# Altium schematic sheet MCU.SchDoc
size A4; SheetNumber: 2; SheetTotal: 6
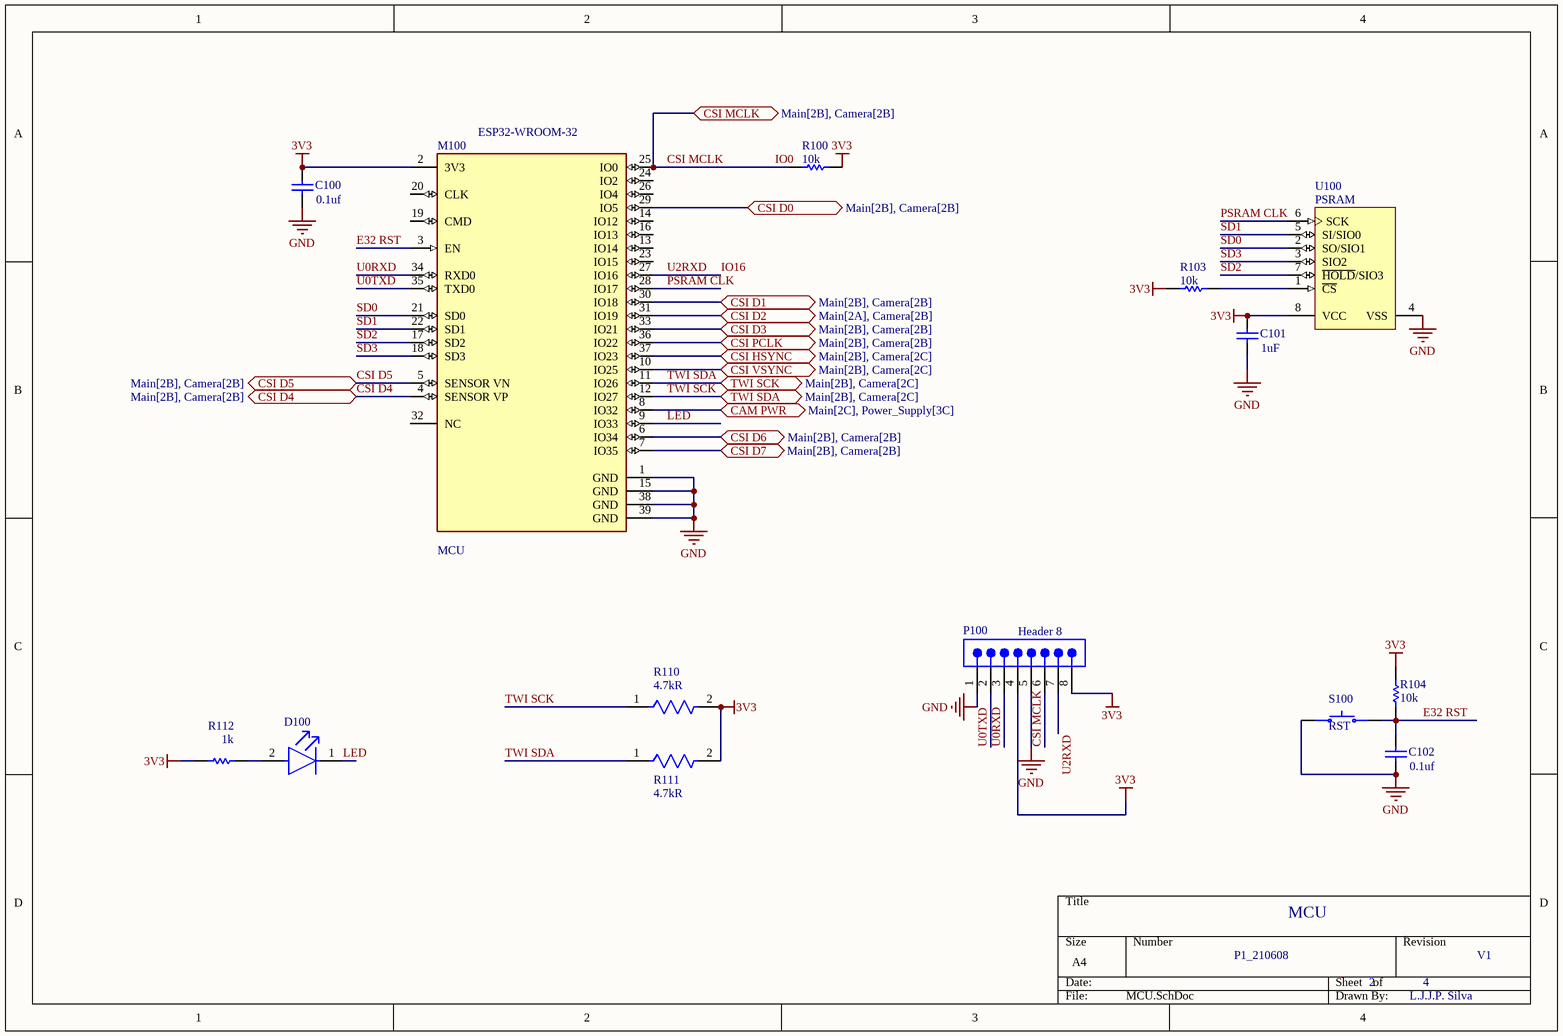
[diagram p0: MCU.SchDoc]

## Parts
C100  Parameter 1: 0.1uf  [CAPC2013X140X50NL20T25]  (hidden comment: 08055C104K4Z2A)
C101  Parameter 1: 1uF  [CAPC2013X145X50LL20T25]  (hidden comment: C0805C105K4PACTU)
C102  Parameter 1: 0.1uf  [CAPC2013X140X50NL20T25]  (hidden comment: 08055C104K4Z2A)
D100  LTST-C190GKT  [FP-LTST-C190GKT-MFG]  (value not drawn)
M100  ESP32-WROOM-32  [FP-ESP32-WROOM-32-MFG]
P100  Header 8  [66200811122]
R100  Parameter 1: 10k  [RESC1609X50X30NL8T20]  (hidden comment: CRCW060310K0FKEA)
R103  Parameter 1: 10k  [RESC1609X50X30NL8T20]  (hidden comment: CRCW060310K0FKEA)
R104  Parameter 1: 10k  [RESC1609X50X30NL8T20]  (hidden comment: CRCW060310K0FKEA)
R110  Resistance: 4.7kR  [FP-ERA3A-IPC_B]  (hidden comment: ERA-3AEB472V)
R111  Resistance: 4.7kR  [FP-ERA3A-IPC_B]  (hidden comment: ERA-3AEB472V)
R112  Parameter 1: 1k  [RESC1608X55X30LL15T15]  (hidden comment: ERJ-3EKF1001V)
S100  value RST  [SW_SKSTACE010]  (hidden comment: SKSTACE010)
U100  PSRAM  [MCHP-SOIC-SN8_N]

## Ports
CAM PWR (bidir, see Main[2C], Power_Supply[3C]), CSI D0 (bidir, see Main[2B], Camera[2B]), CSI D1 (bidir, see Main[2B], Camera[2B]), CSI D2 (bidir, see Main[2A], Camera[2B]), CSI D3 (bidir, see Main[2B], Camera[2B]), CSI D4 (bidir, see Main[2B], Camera[2B]), CSI D5 (bidir, see Main[2B], Camera[2B]), CSI D6 (bidir, see Main[2B], Camera[2B]), CSI D7 (bidir, see Main[2B], Camera[2B]), CSI HSYNC (bidir, see Main[2B], Camera[2C]), CSI MCLK (bidir, see Main[2B], Camera[2B]), CSI PCLK (bidir, see Main[2B], Camera[2B]), CSI VSYNC (bidir, see Main[2B], Camera[2C]), TWI SCK (bidir, see Main[2B], Camera[2C]), TWI SDA (bidir, see Main[2B], Camera[2C])

## Nets
3V3: C100.2 C101.2 M100.2(3V3) P100.4 P100.8 R100.2 R103.2 R104.2 R110.2 R111.2 R112.1 U100.8(VCC)
GND: C100.1 C101.1 C102.1 M100.1(GND) M100.15(GND) M100.38(GND) M100.39(GND) P100.1 P100.5 S100.1 U100.4(VSS)
CAM PWR: M100.8(IO32) ; port CAM PWR
CSI D0: M100.29(IO5) ; port CSI D0
CSI D1: M100.30(IO18) ; port CSI D1
CSI D2: M100.31(IO19) ; port CSI D2
CSI D3: M100.33(IO21) ; port CSI D3
CSI D4: M100.4(SENSOR_VP) ; port CSI D4
CSI D5: M100.5(SENSOR_VN) ; port CSI D5
CSI D6: M100.6(IO34) ; port CSI D6
CSI D7: M100.7(IO35) ; port CSI D7
CSI HSYNC: M100.37(IO23) ; port CSI HSYNC
CSI MCLK: M100.25(IO0) P100.6 R100.1 ; port CSI MCLK  [also labelled IO0]
CSI PCLK: M100.36(IO22) ; port CSI PCLK
CSI VSYNC: M100.10(IO25) ; port CSI VSYNC
E32 RST: C102.2 M100.3(EN) R104.1 S100.2
IO16: M100.27(IO16) P100.7  [also labelled U2RXD]
LED: D100.1(C) M100.9(IO33)
PSRAM CLK: M100.28(IO17) U100.6(SCK)
SD0: M100.21(SD0) U100.2(SO/SIO1)
SD1: M100.22(SD1) U100.5(SI/SIO0)
SD2: M100.17(SD2) U100.7(~{HOLD}/SIO3)
SD3: M100.18(SD3) U100.3(SIO2)
TWI SCK: M100.12(IO27) R110.1 ; port TWI SDA
TWI SDA: M100.11(IO26) R111.1 ; port TWI SCK
U0RXD: M100.34(RXD0) P100.3
U0TXD: M100.35(TXD0) P100.2
NetD100_2: D100.2(A) R112.2
NetR103_1: R103.1 U100.1(~{CS})

Not connected (* = marked no-connect by the designer): M100 13(IO14) 14(IO12) 16(IO13) 19(CMD) 20(CLK) 23(IO15) 24(IO2) 26(IO4) 32(NC)

## Notes on the sheet
- (near M100) MCU
- MCU
- P1_210608
- 2
- 4
- V1
- L.J.J.P. Silva

## Library data of the parts
C100 C102 = CMP-2007-04629-1: Manufacturer: AVX Interconnect / Elco; Part Number: 08055C104K4Z2A
C101 = CMP-1036-04746-2: Manufacturer: Kemet; Part Number: C0805C105K4PACTU
D100 = CMP-22017-000005-2: LED GREEN CLEAR CHIP SMD; Dominant Wavelength: 569nm; Reverse Voltage: 5V; Lens Color: Colorless; Viewing Angle: 130°; Voltage: 2V; Forward Current: 30mA; Power Dissipation: 100mW; Luminous Intensity: 6mcd; Number of LEDs: 1; Forward Voltage: 2.1V; Wavelength: 565nm; Test Current: 10mA; Min Operating Temperature: -55°C; Lens Style: Clear; Mount: Surface Mount; Width: 0.8mm; Packaging: Tape and Reel; Lens Transparency: Clear; Case Code (Metric): 1608; Depth: 0.8mm; Case Code (Imperial): 0603; Case/Package: 0603; Number of Pins: 2; Max Operating Temperature: 85°C; Lead Free: Lead Free; Number of Elements: 1; Length: 1.6mm; Height: 0.8mm; Package Quantity: 1; Power Rating: 100mW; Radiation Hardening: No; Illumination Color: Green; Color: Green; Parameter 1: LED
M100 = CMP-194065-000008-1: RX TXRX MOD WIFI SURFACE MOUNT; Frequency: 2.5GHz; Sensitivity: -98dBm; Operating Supply Voltage: 3.6V; Data Rate: 150Mbps; Weight: 0.088185oz; Package Quantity: 550; Min Operating Temperature: -40°C; Mount: Surface Mount; Max Operating Temperature: 85°C; Packaging: Cut Tape; Case/Package: SMD/SMT
P100 = CMP-1502-00446-2: NexarPartId: 23024701; Pitch: 3mm; Number of Contacts: 8; Insulation Resistance: 1GΩ; Connector Type: Male Pin, Socket; Contact Resistance: 10mΩ; Gender: Male; Current Rating: 5A; Operating Supply Voltage: 250V; Height: 11mm; Max Operating Temperature: 105°C; Mount: Through Hole; Orientation: Vertical; Fastening Type: Ramp; Number of Positions: 8; Lead Pitch: 3mm; Number of Rows: 1; RoHS: Compliant; Termination: Kinked Pin; Width: 27.65mm; Contact Material: Copper; REACH SVHC: Unknown; Contact Plating: Tin; Length: 27.65mm; Color: Black; Min Operating Temperature: -40°C; Number of Pins: 8
R100 R103 R104 = CMP-1666-00005-4: Chip Resistor, 10 KOhm, +/- 1%, 100 mW, -55 to 155 degC, 0603 (1608 Metric), RoHS, Tape and Reel; Manufacturer: Vishay Semiconductor; Voltage Rating: 75 V; Max Operating Temperature: 155 degC; PackageDescription: 2-Pin Surface Mount Device, Body 1.575 x 0.85 mm; ComponentLink1Description: Manufacturer URL; RoHSCompliant: true; PackageReference: 0603; REACH SVHC: Unknown; Length: 1.55 mm; DatasheetVersion: 06/2012; Packaging: Tape and Reel; Min Operating Temperature: -55 degC; Mounting Technology: Surface Mount; ComponentLink2URL: https://datasheet.ciiva.com/11809/0900766b80d98afc-11809037.pdf; Height: 0.45 mm; ComponentLink2Description: Datasheet; Package Quantity: 5000; ComponentLink1URL: http://www.vishay.com/
R110 R111 = CMP-2000-00072-2: RES SMD 4.7K OHM 0.1% 1/10W 0603; Voltage Rating: 75V; Max Power Dissipation: 100mW; Temperature Coefficient: 25ppm/°C; Case Code (Imperial): 0603; RoHS Compliant: Yes; Number of Pins: 2; REACH SVHC: No SVHC; Height: 0.45mm; Lead Free: Lead Free; Packaging: Tape and Reel; Width: 0.8mm; Termination: SMD/SMT; Radiation Hardening: No; Working Voltage: 75V; Max Operating Temperature: 155°C; Resistance Tolerance: 0.1%; Min Operating Temperature: -55°C; Mount: Surface Mount; Case/Package: 0603; Package Quantity: 5000; Number of Terminations: 2; Resistor Type: Thin Film; Voltage Rating (DC): 75V; Tolerance: 0.1%; Construction: Rectangular; Military Standard: Not; Length: 1.6mm; Series: ERA-3A; Power Rating: 100mW; Contact Plating: Tin; Technology: THIN FILM; Case Code (Metric): 1608; Depth: 0.8mm; Parameter 1: *
R112 = CMP-2000-00180-1: Manufacturer: Panasonic; Part Number: ERJ-3EKF1001V
S100 = SKSTACE010: Switch Tactile N.O. SPST Round Button J-Bend 0.05A 16VDC 500000Cycles 4N SMD T/R; Package: None; Price: None; MP: SKSTACE010; Availability: Unavailable
U100 = CMP-0163-00041-1: 512K bits SPI Serial SRAM with SDI and SQI Interface, 2.5 to 5.5 V, 20 MHz, -40 to 85 degC, 8-pin SOIC (SN8), Tube; Manufacturer: Microchip; PartNumber: 23LC512-I/SN; ComponentLink1Description: Manufacturer URL; DatasheetVersion: Rev. A; ComponentLink3Description: Package Specification; ComponentLink2URL: http://ww1.microchip.com/downloads/en/DeviceDoc/25155A.pdf; ComponentLink4Description: Product URL; ComponentLink4URL: http://www.microchip.com/23LC512; PackageReference: SOIC-SN8; PackageVersion: C04-057C; ComponentLink1URL: http://www.microchip.com; ComponentLink2Description: Datasheet; PackageDescription: 8-Lead Plastic Small Outline, 4.9 x 3.9 mm Body, 1.27 mm Pitch; ComponentLink3URL: http://www.microchip.com/stellent/groups/techpub_sg/documents/packagingspec/en012702.pdf; Mounting Technology: Surface Mount